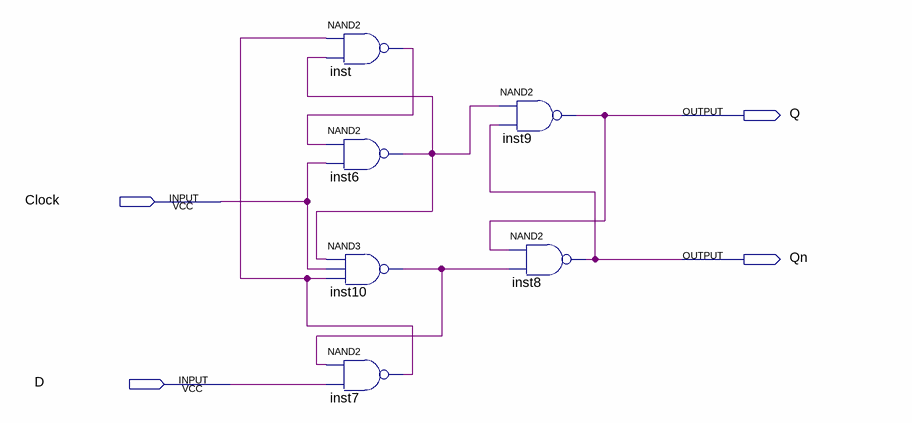
[diagram p0: schematic sheet]
// Quartus schematic lab9step3b.bdf as structural Verilog: 6 symbols, 4 pins
module lab9step3b (
  input  Clock,
  input  D,
  output Q,
  output Qn
);

  wire inst6_out, inst7_out, inst10_out, inst_out;

  nand inst (inst_out, inst7_out, inst6_out);
  nand inst6 (inst6_out, inst_out, Clock);
  nand inst10 (inst10_out, inst6_out, Clock, inst7_out);
  nand inst7 (inst7_out, inst10_out, D);
  nand inst9 (Q, inst6_out, Qn);
  nand inst8 (Qn, Q, inst10_out);
endmodule
